# Altium schematic sheet power.SchDoc: Ultrasonic
size Letter; Author: Kuo, Huang; Revision: 2.0; SheetNumber: 4; SheetTotal: 7
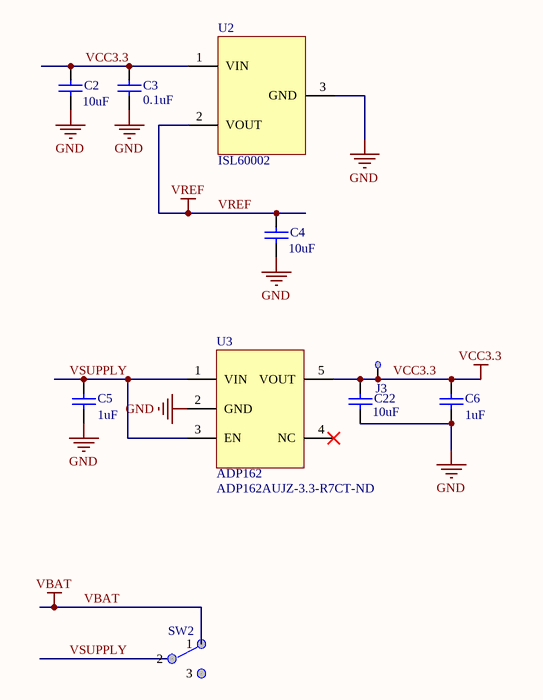
[diagram p0: power.SchDoc]

## Parts
C2  value 10uF  [1608[0603]]  (hidden comment: Cap Semi)
C3  value 0.1uF  [1608[0603]]  (hidden comment: Cap Semi)
C4  value 10uF  [1608[0603]]  (hidden comment: Cap Semi)
C5  value 1uF  [1608[0603]]  (hidden comment: Cap Semi)
C6  value 1uF  [1608[0603]]  (hidden comment: Cap Semi)
C22  value 10uF  [1608[0603]]  (hidden comment: Cap Semi)
J3  5004  [TestPoint]  (value not drawn)
SW2  EG1218  [Slide Switch SPDT]  (value not drawn)
U2  ISL60002  [SOT23-3N]
U3  ADP162  Supplier Part Number 1: ADP162AUJZ-3.3-R7CT-ND  [TSOT23-5]

## Nets
GND: C2.1 C3.1 C4.1 C5.1 C6.1 C22.1 U2.3(GND) U3.2(GND)
VBAT: SW2.1
VCC3.3: C2.2 C3.2 C6.2 C22.2 J3.1(TB) U2.1(VIN) U3.5(VOUT)
VREF: C4.2 U2.2(VOUT)
VSUPPLY: C5.2 SW2.2 U3.1(VIN) U3.3(EN)

Not connected (* = marked no-connect by the designer): SW2 3; U3 4(NC)*

## Notes on the sheet
- Title
- Date:
- Author:
- Revision:
- Sheet
- of
- University of Michigan
- File:

## Library data of the parts
C2-C6 C22 = Cap Semi: Capacitor (Semiconductor SIM Model); Published: 8-Jun-2000; LatestRevisionDate: 29-May-2009; LatestRevisionNote: IPC-7351 Footprint Added.; PackageReference: C1206; Publisher: Altium Limited; PackageDescription: Chip Capacitor
J3 = TestPoint: TEST POINT PC MINI .040"D YELLOW; Supplier 1: Digi-Key; Supplier Part Number 1: 5004K-ND; datasheet: http://mail.keyelco.com/ENG._DEPT/PDF%20CAT%20NO%20Drawings/5004.pdf
SW2 = EG1218: Switch 3 Pos; Supplier 1: Digi-Key; Supplier Part Number 1: EG1903-ND; Supplier 2: Digi-Key; Supplier Part Number 2: 450-1598-ND; Supplier 3: Digi-Key; Supplier Part Number 3: 450-1577-ND
U2 = ISL60002: Precision Low Power FGA? Voltage References; Supplier 1: Digi-Key; Supplier Part Number 1: ISL60002DIH310Z-TKCT-ND
U3 = ADP162: Ultralow Quiescent Current,  150 mA, CMOS Linear Regulators; Supplier 1: Digi-Key